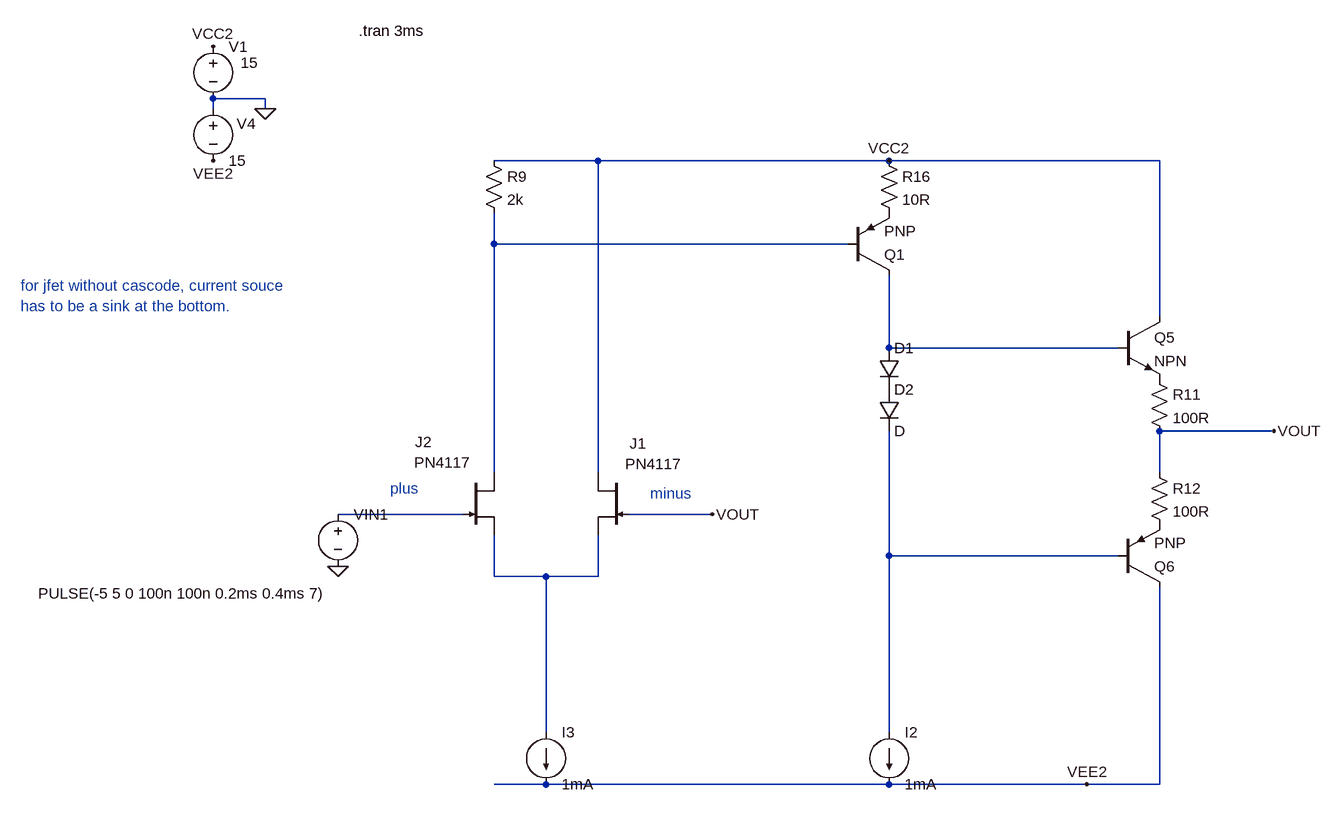
[diagram p0: schematic Draft45.asc]
Draft45.asc, the LTspice schematic file:
Version 4
SHEET 1 1508 952
WIRE -256 -288 -336 -288
WIRE -336 -272 -336 -288
WIRE -256 -272 -256 -288
WIRE 256 -192 96 -192
WIRE 704 -192 256 -192
WIRE 1120 -192 704 -192
WIRE 96 -64 96 -112
WIRE 640 -64 96 -64
WIRE 1120 48 1120 -192
WIRE 704 96 704 -16
WIRE 1056 96 704 96
WIRE 1296 224 1120 224
WIRE 96 288 96 -64
WIRE 256 288 256 -192
WIRE 1120 288 1120 224
WIRE 48 352 -144 352
WIRE 432 352 304 352
WIRE 704 416 704 224
WIRE 1056 416 704 416
WIRE 96 448 96 384
WIRE 176 448 96 448
WIRE 256 448 256 384
WIRE 256 448 176 448
WIRE 176 688 176 448
WIRE 704 688 704 416
WIRE 176 768 96 768
WIRE 704 768 176 768
WIRE 1008 768 704 768
WIRE 1120 768 1120 464
WIRE 1120 768 1008 768
FLAG -256 -272 0
FLAG -336 -368 VCC2
FLAG -336 -192 VEE2
FLAG 704 -192 VCC2
FLAG 1008 768 VEE2
FLAG 1296 224 VOUT
FLAG -144 432 0
FLAG 432 352 VOUT
SYMBOL voltage -336 -384 R0
WINDOW 123 0 0 Left 0
WINDOW 39 0 0 Left 0
WINDOW 3 42 41 Left 2
SYMATTR Value 15
SYMATTR InstName V1
SYMBOL voltage -336 -288 R0
WINDOW 123 0 0 Left 0
WINDOW 39 0 0 Left 0
WINDOW 0 36 39 Left 2
SYMATTR InstName V4
SYMATTR Value 15
SYMBOL npn 1056 48 R0
SYMATTR InstName Q5
SYMBOL res 1104 128 R0
SYMATTR InstName R11
SYMATTR Value 100R
SYMBOL res 1104 272 R0
SYMATTR InstName R12
SYMATTR Value 100R
SYMBOL pnp 1056 464 M180
SYMATTR InstName Q6
SYMBOL voltage -144 336 R0
WINDOW 123 0 0 Left 0
WINDOW 39 0 0 Left 0
WINDOW 3 -461 138 Left 2
SYMATTR Value PULSE(-5 5 0 100n 100n 0.2ms 0.4ms 7)
SYMATTR InstName VIN1
SYMBOL res 80 -208 R0
SYMATTR InstName R9
SYMATTR Value 2k
SYMBOL res 688 -208 R0
SYMATTR InstName R16
SYMATTR Value 10R
SYMBOL diode 688 96 R0
SYMATTR InstName D1
SYMBOL diode 688 160 R0
SYMATTR InstName D2
SYMBOL current 704 688 R0
WINDOW 123 0 0 Left 0
WINDOW 39 0 0 Left 0
SYMATTR InstName I2
SYMATTR Value 1mA
SYMBOL njf 48 288 R0
WINDOW 0 257 -45 Left 2
WINDOW 3 -75 -16 Left 2
SYMATTR InstName J1
SYMATTR Value PN4117
SYMBOL njf 304 288 M0
WINDOW 0 329 -47 Right 2
WINDOW 3 6 -13 Right 2
SYMATTR InstName J2
SYMATTR Value PN4117
SYMBOL current 176 688 R0
WINDOW 123 0 0 Left 0
WINDOW 39 0 0 Left 0
SYMATTR InstName I3
SYMATTR Value 1mA
SYMBOL pnp 640 -16 M180
SYMATTR InstName Q1
TEXT -112 -392 Left 2 !.tran 3ms
TEXT 336 320 Left 2 ;minus
TEXT -632 0 Left 2 ;for jfet without cascode, current souce \nhas to be a sink at the bottom.
TEXT -64 312 Left 2 ;plus

The netlist it stands for:
* Draft45.asc
V1 VCC2 0 15
V4 0 VEE2 15
Q5 VCC2 N002 P001 0 NPN
R11 P001 VOUT 100R
R12 VOUT P002 100R
Q6 VEE2 N004 P002 0 PNP
VIN1 N003 0 PULSE(-5 5 0 100n 100n 0.2ms 0.4ms 7)
R9 VCC2 N001 2k
R16 VCC2 P003 10R
D1 N002 P004 D
D2 P004 N004 D
I2 N004 VEE2 1mA
J1 N001 N003 N005 PN4117
J2 VCC2 VOUT N005 PN4117
I3 N005 VEE2 1mA
Q1 N002 N001 P003 0 PNP
.model D D
.lib standard.dio
.model NPN NPN
.model PNP PNP
.lib standard.bjt
.model NJF NJF
.model PJF PJF
.lib standard.jft
.tran 3ms
* minus
* for jfet without cascode, current souce
* has to be a sink at the bottom.
* plus
.backanno
.end